# EAGLE design USBConnectors_v1 (EAGLE 9.6.2)

## Sheet 1 of 3: MAIN
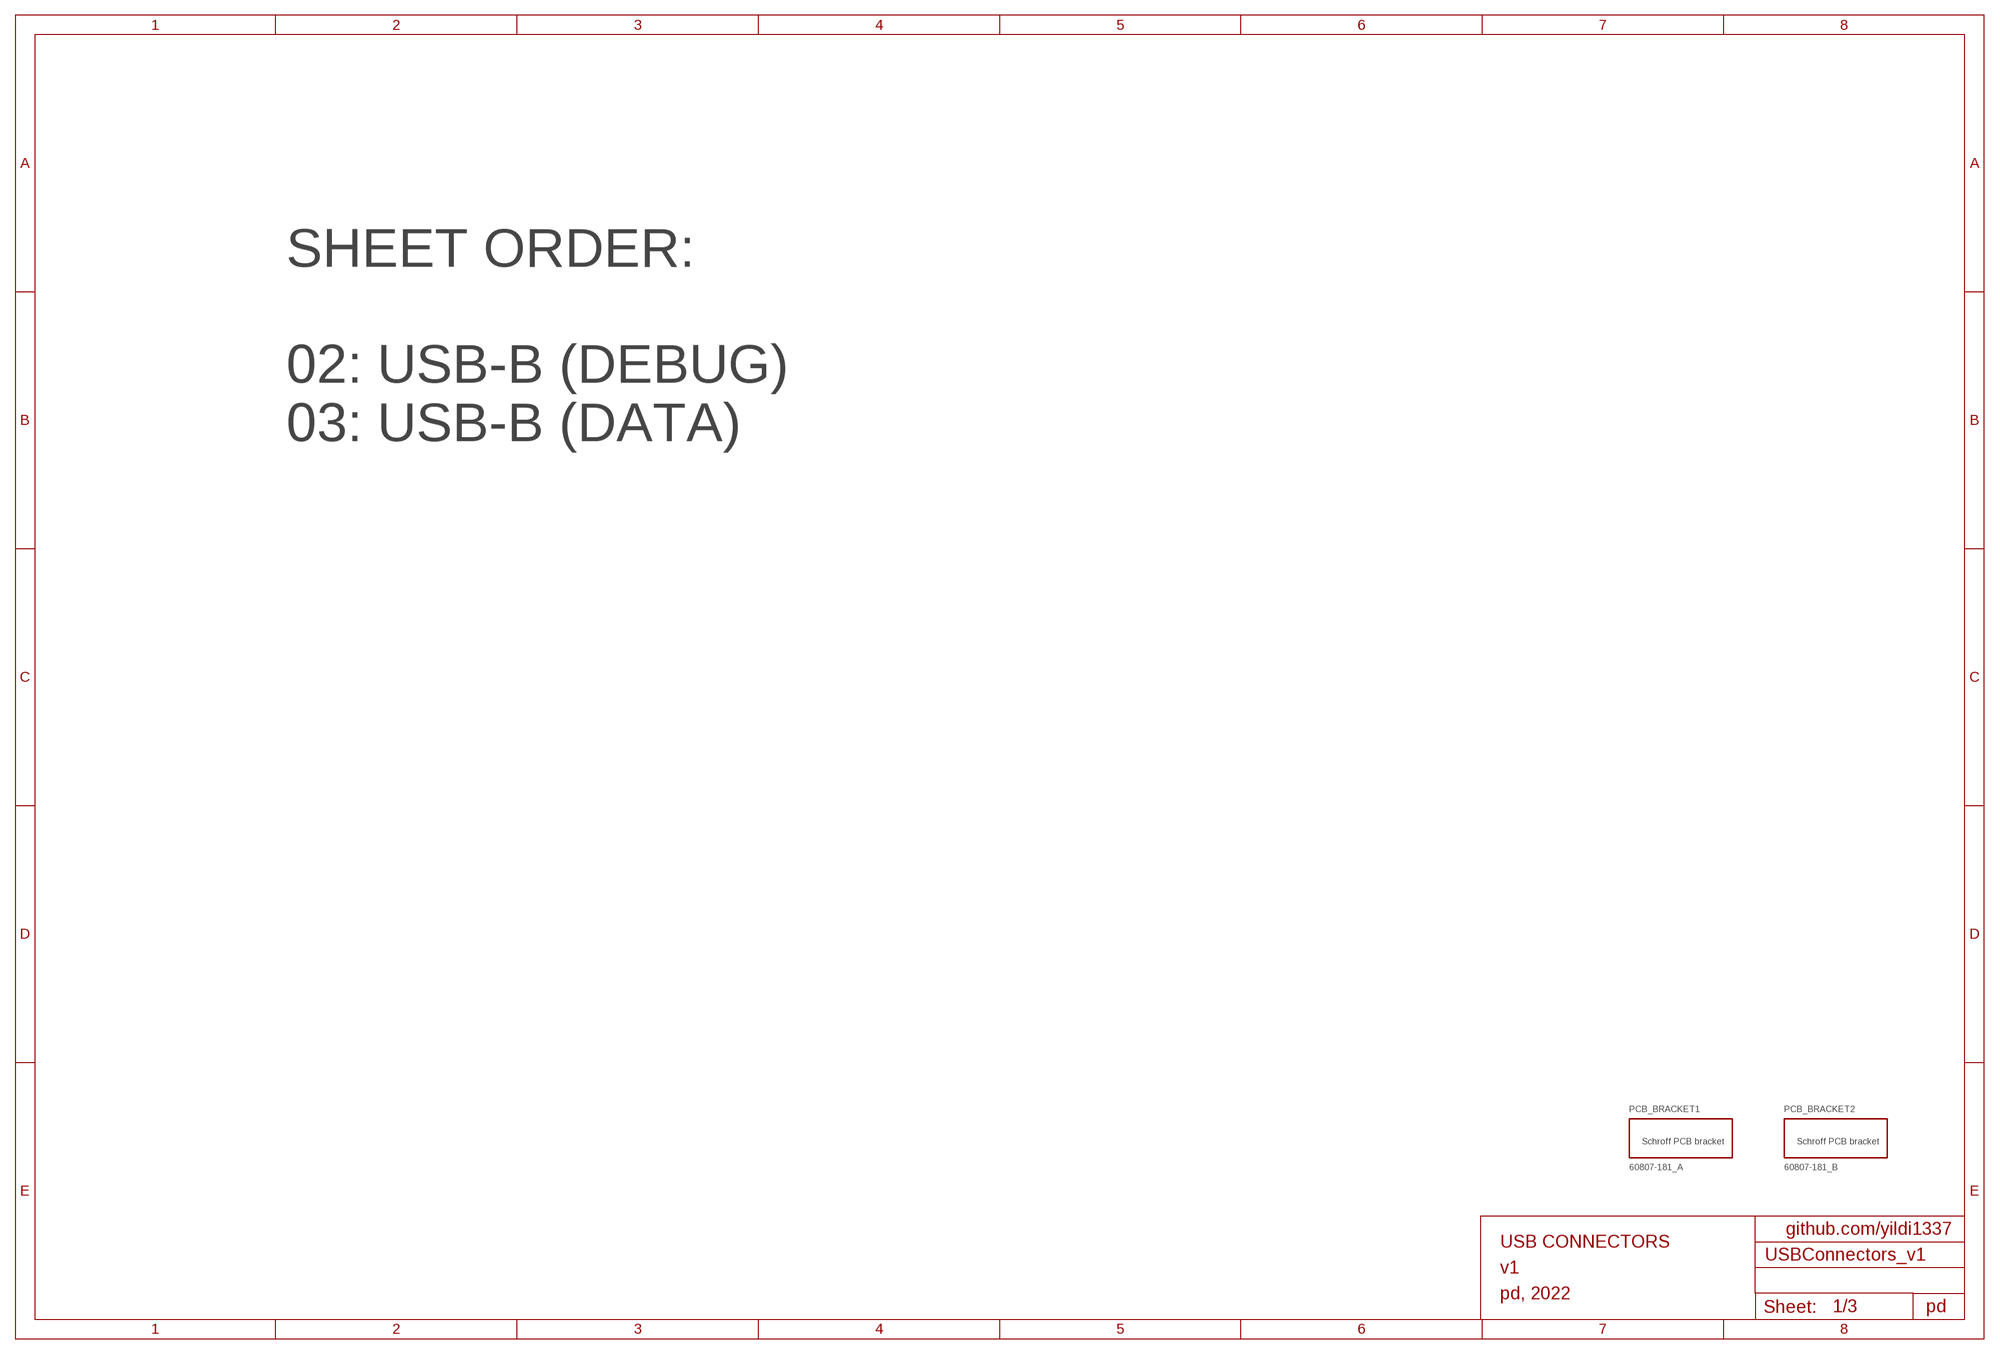
[diagram p0: schematic, sheet 1]

### Parts
PCB_BRACKET1  60807-181_A  [60807-181_A]
PCB_BRACKET2  60807-181_B  [60807-181_B]

### Notes on the sheet
- SHEET ORDER:
  
  02: USB-B (DEBUG)
  03: USB-B (DATA)
- github.com/yildi1337
- USB CONNECTORS
- v1
- pd, 2022
- pd

## Sheet 2 of 3: USB-B (DEBUG)
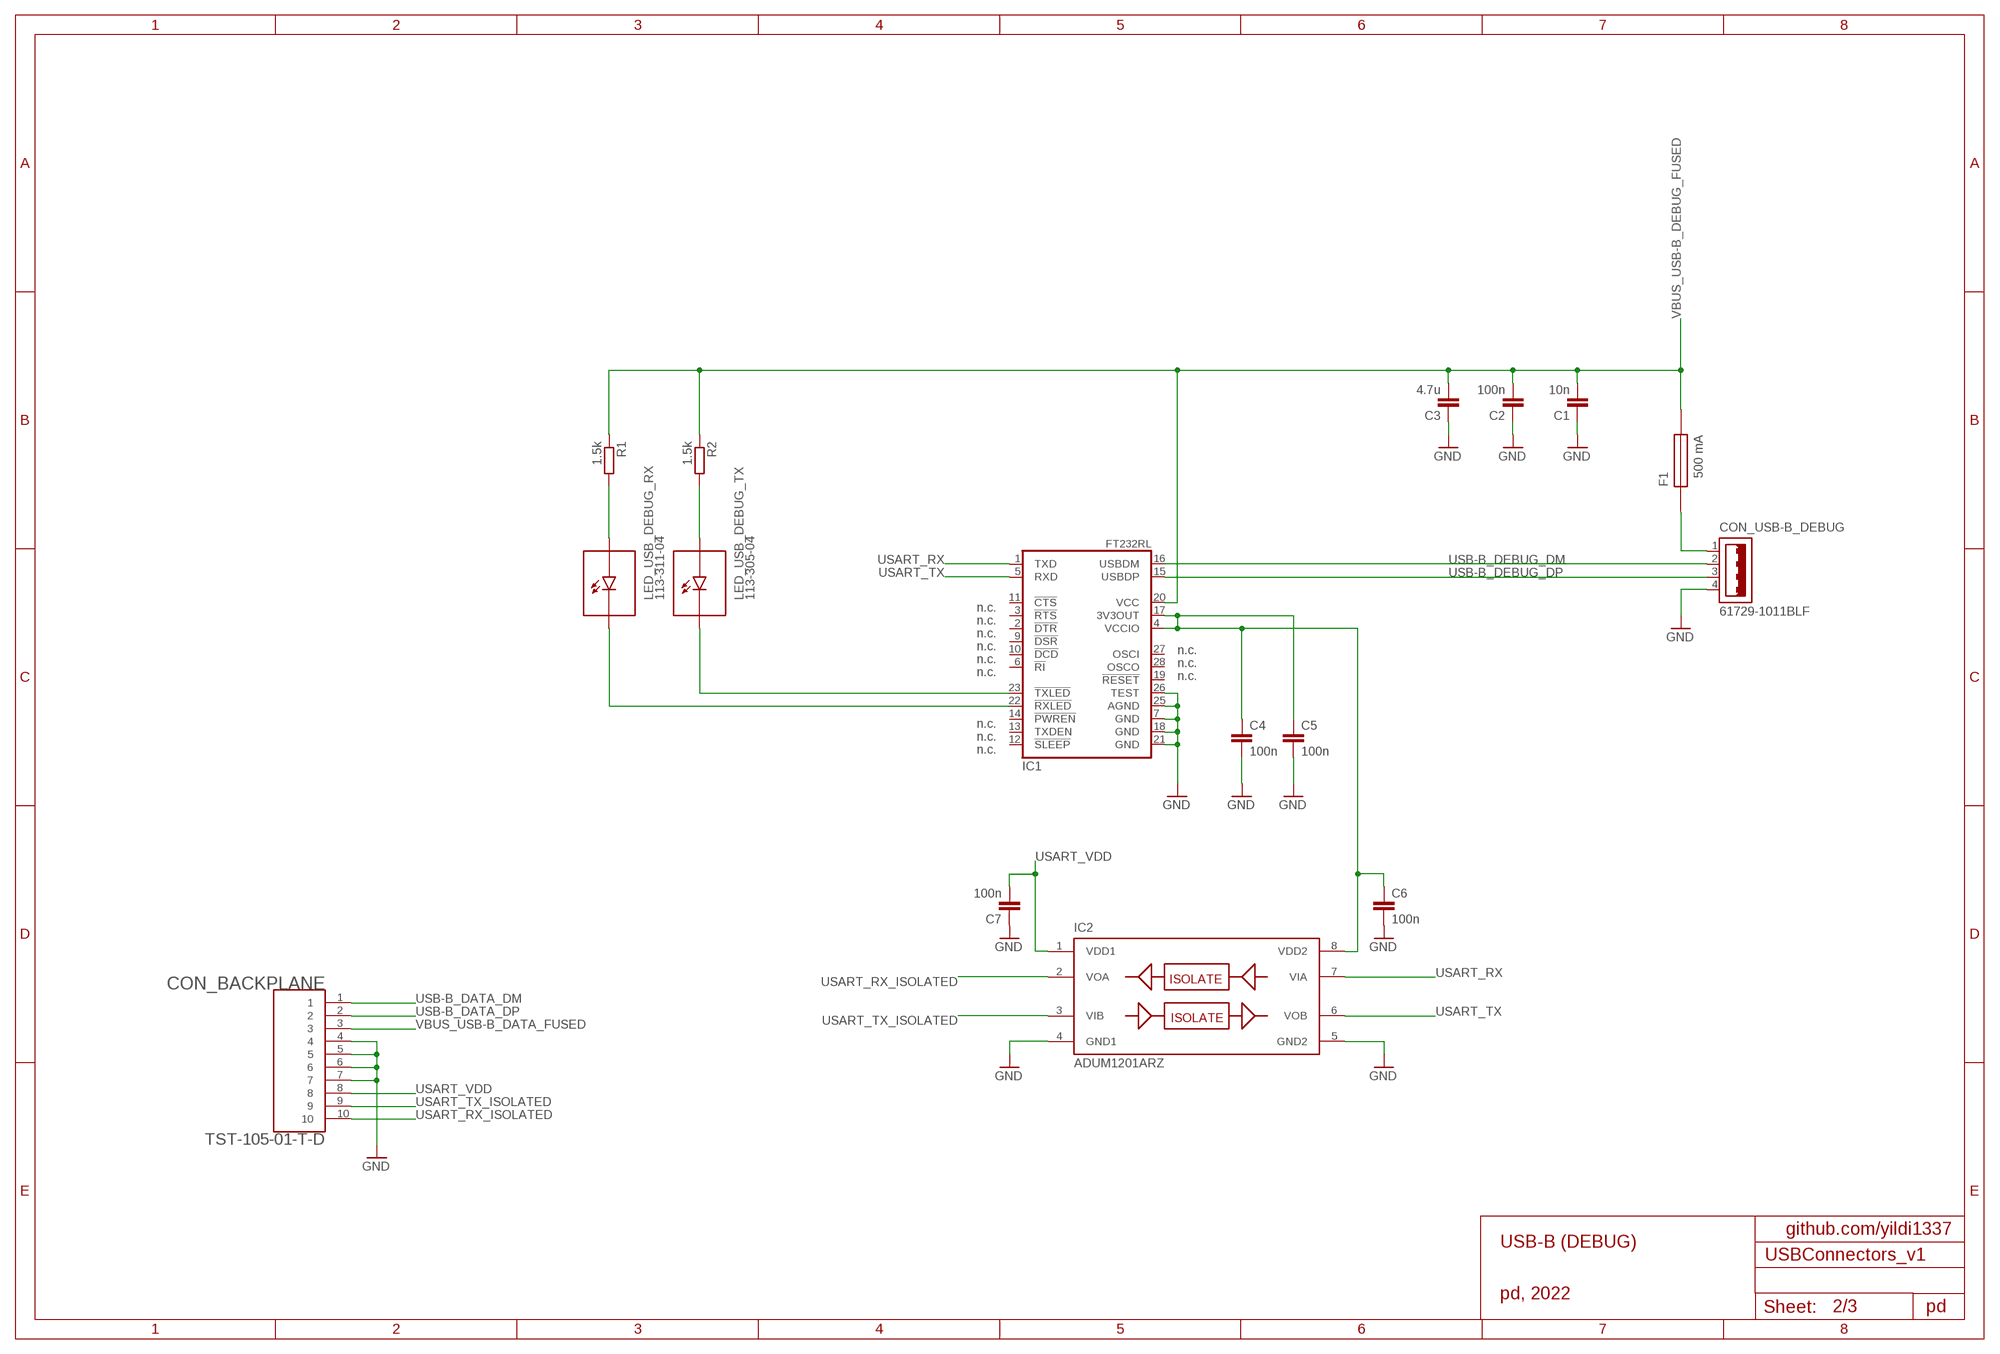
[diagram p1: schematic, sheet 2]

### Parts
C1  10n  C-EUC0603  [C0603]
C2  100n  C-EUC0603  [C0603]
C3  4.7u  C-EUC0603  [C0603]
C4  100n  C-EUC0603  [C0603]
C5  100n  C-EUC0603  [C0603]
C6  100n  C-EUC0603  [C0603]
C7  100n  C-EUC0603  [C0603]
CON_BACKPLANE  TST-105-01-T-D  [TST-105-01-T-D]
CON_USB-B_DEBUG  61729-1011BLF  [61729-1011BLF]
F1  500 mA  LITTELFUSE_466_SERIES  [LITTELFUSE_466_SERIES]
IC1  FT232RL  [FT232RL]
IC2  ADUM1201ARZ  ADUM1201  [SO8]
LED_USB_DEBUG_RX  113-311-04  [113-311-04]
LED_USB_DEBUG_TX  113-305-04  [113-305-04]
R1  1.5k  R-EU_R0603  [R0603]
R2  1.5k  R-EU_R0603  [R0603]

### Nets
GND: C1.2 C2.1 C3.1 C4.2 C5.2 C6.2 C7.1 CON_BACKPLANE.4 CON_BACKPLANE.5 CON_BACKPLANE.6 CON_BACKPLANE.7 CON_USB-B_DEBUG.4 IC1.7(GND) IC1.18(GND) IC1.21(GND) IC1.25(AGND) IC1.26(TEST) IC2.4(GND1) IC2.5(GND2) ; also sheet 3
N$1: CON_USB-B_DEBUG.1 F1.1
N$3: LED_USB_DEBUG_RX.+(A) R1.2
N$4: LED_USB_DEBUG_TX.+(A) R2.2
N$59: C4.1 C5.1 C6.1 IC1.4(VCCIO) IC1.17(3V3OUT) IC2.8(VDD2)
N$61: IC1.22(!RXLED) LED_USB_DEBUG_RX.-(C)
N$63: IC1.23(!TXLED) LED_USB_DEBUG_TX.-(C)
USART_RX: IC1.1(TXD) IC2.7(VIA)
USART_RX_ISOLATED: CON_BACKPLANE.10 IC2.2(VOA)
USART_TX: IC1.5(RXD) IC2.6(VOB)
USART_TX_ISOLATED: CON_BACKPLANE.9 IC2.3(VIB)
USART_VDD: C7.2 CON_BACKPLANE.8 IC2.1(VDD1)
USB-B_DATA_DM: CON_BACKPLANE.1 ; also sheet 3
USB-B_DATA_DP: CON_BACKPLANE.2 ; also sheet 3
USB-B_DEBUG_DM: CON_USB-B_DEBUG.2 IC1.16(USBDM)
USB-B_DEBUG_DP: CON_USB-B_DEBUG.3 IC1.15(USBDP)
VBUS_USB-B_DATA_FUSED: CON_BACKPLANE.3 ; also sheet 3
VBUS_USB-B_DEBUG_FUSED: C1.1 C2.2 C3.2 F1.2 IC1.20(VCC) R1.1 R2.1
Unconnected: IC1.2(!DTR) IC1.3(!RTS) IC1.6(!RI) IC1.9(!DSR) IC1.10(!DCD) IC1.11(!CTS) IC1.12(!SLEEP) IC1.13(TXDEN) IC1.14(!PWREN) IC1.19(!RESET) IC1.27(OSCI) IC1.28(OSCO)

### Notes on the sheet
- n.c.
- n.c.
- n.c.
- n.c.
- n.c. | n.c.
- n.c. | n.c.
- n.c.
- n.c.
- n.c.
- n.c.
- github.com/yildi1337
- USB-B (DEBUG)
- pd, 2022
- pd

## Sheet 3 of 3: USB-B (DATA)
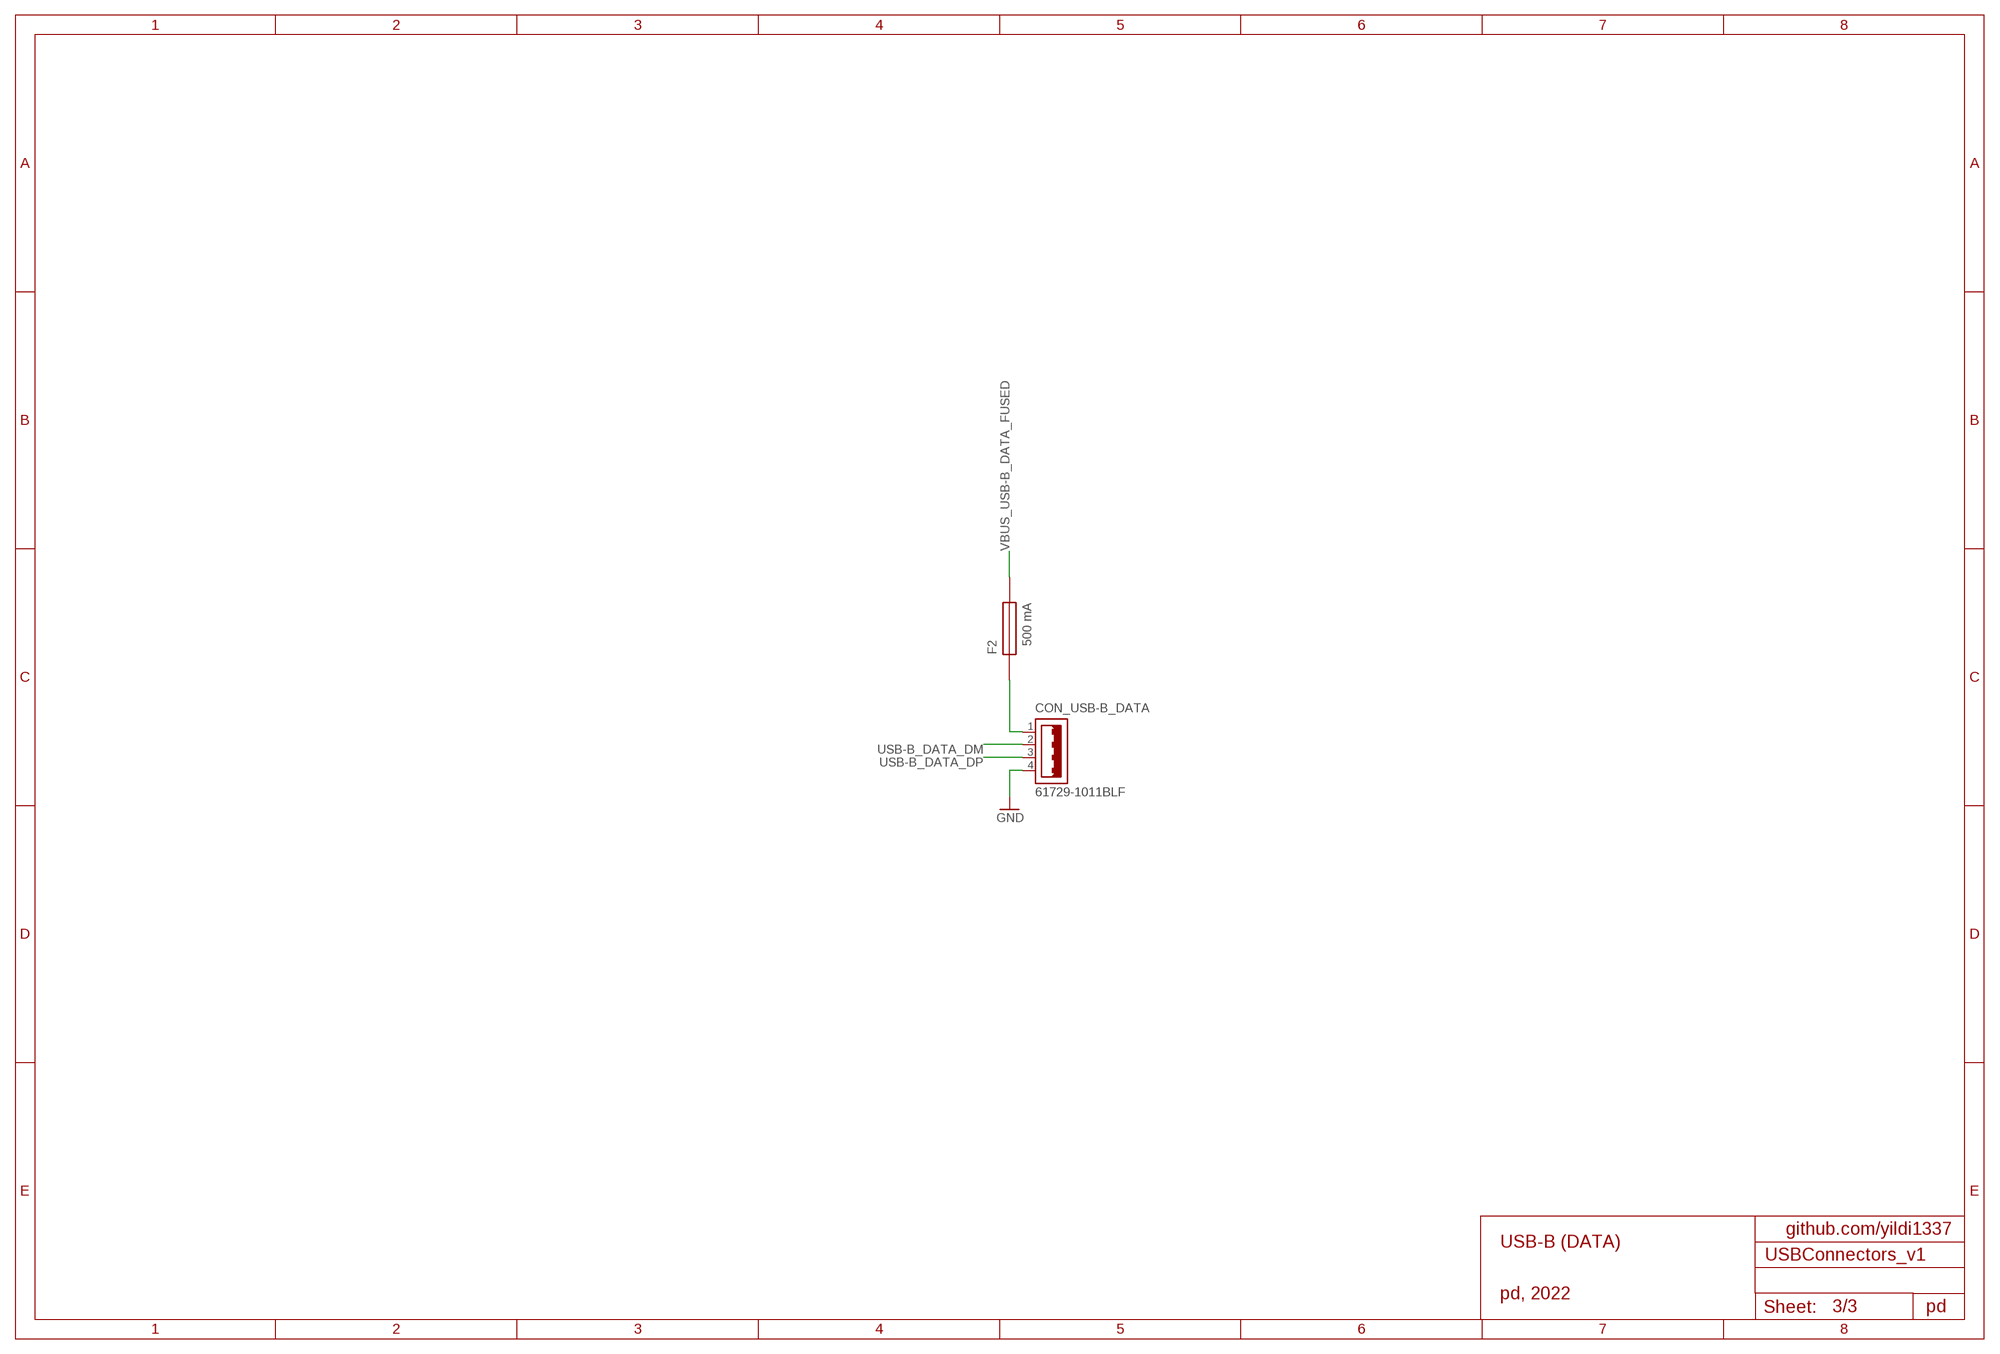
[diagram p2: schematic, sheet 3]

### Parts
CON_USB-B_DATA  61729-1011BLF  [61729-1011BLF]
F2  500 mA  LITTELFUSE_466_SERIES  [LITTELFUSE_466_SERIES]

### Nets
GND: CON_USB-B_DATA.4 ; also sheet 2
USB-B_DATA_DM: CON_USB-B_DATA.2 ; also sheet 2
USB-B_DATA_DP: CON_USB-B_DATA.3 ; also sheet 2
VBUS_USB-B_DATA_FUSED: F2.2 ; also sheet 2
VBUS_USB-B_NF: CON_USB-B_DATA.1 F2.1

### Notes on the sheet
- github.com/yildi1337
- USB-B (DATA)
- pd, 2022
- pd

## Library data of the parts
C1-C7 = RCL:C-EU: CAPACITOR, European symbol; SPICEPREFIX: C
CON_BACKPLANE = TST-105-01-T-D:TST-105-01-T-D
CON_USB-B_DATA CON_USB-B_DEBUG = 61729-1011BLF:61729-1011BLF
F1 F2 = LITTELFUSE_466_SERIES:LITTELFUSE_466_SERIES
IC1 = FT232RL:FT232RL
IC2 = ADUM120X:ADUM1201
LED_USB_DEBUG_RX = 113-311-04:113-311-04
LED_USB_DEBUG_TX = 113-305-04:113-305-04
PCB_BRACKET1 = 60807-181:60807-181_A
PCB_BRACKET2 = 60807-181:60807-181_B
R1 R2 = RCL:R-EU_: RESISTOR, European symbol; SPICEPREFIX: R

## Board
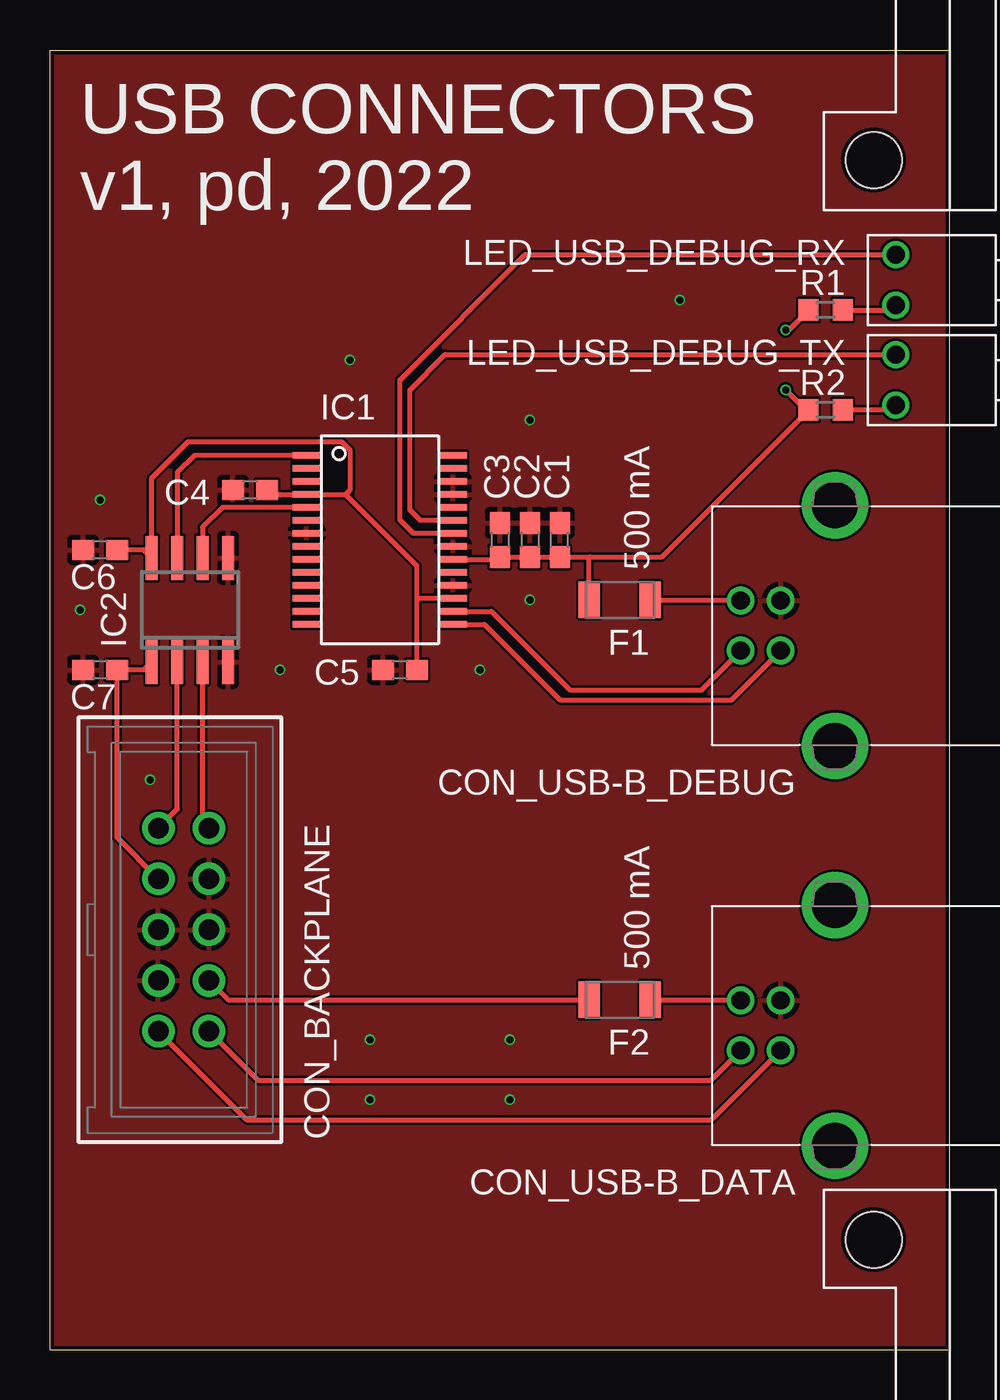
[diagram p3: board, top side]
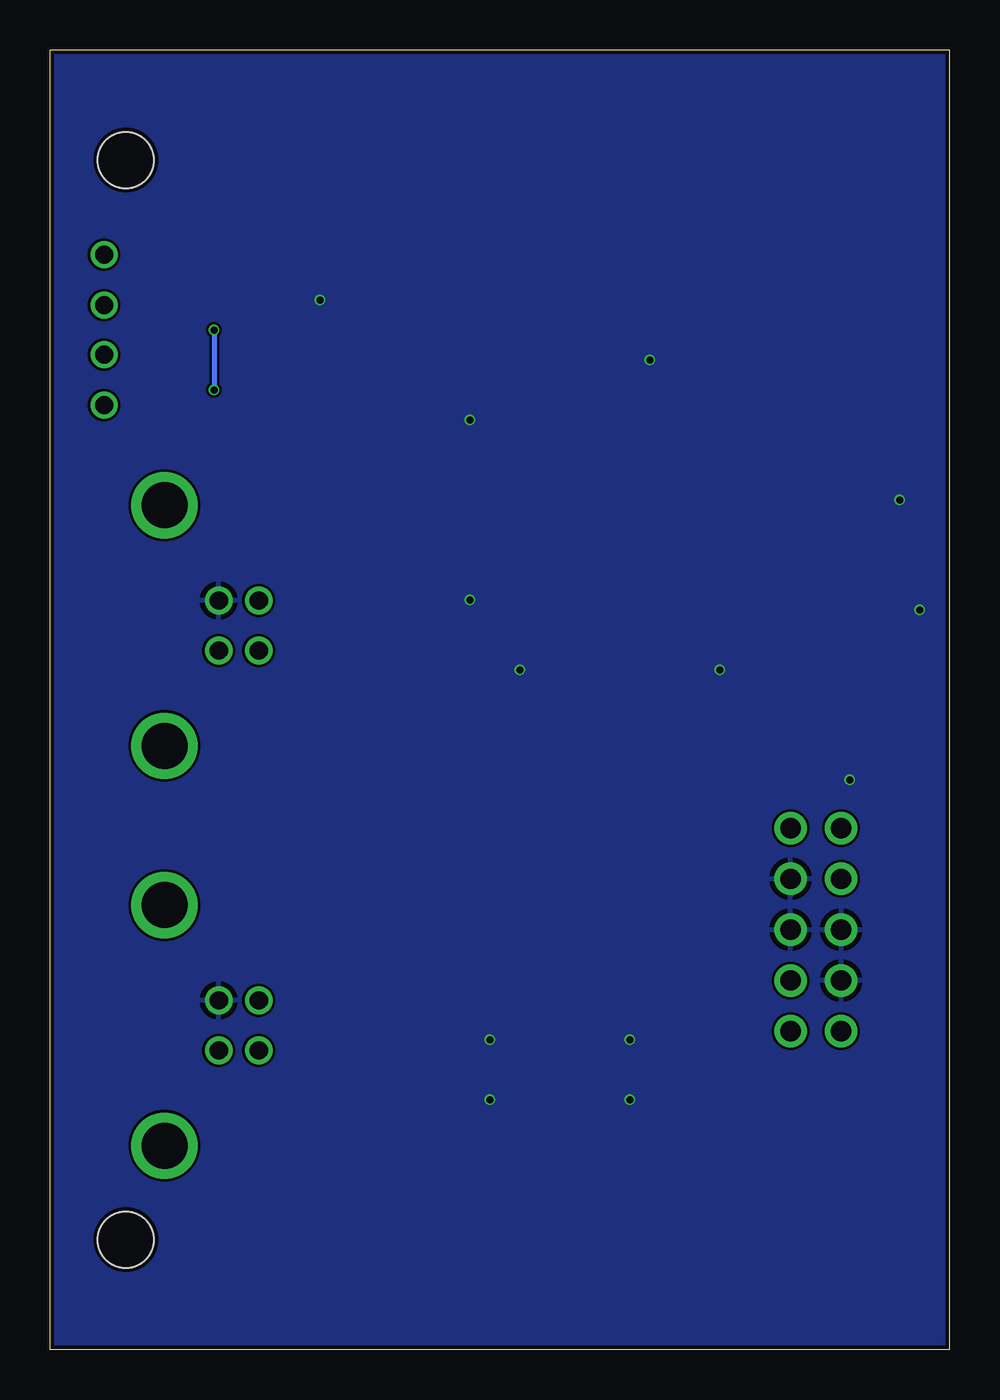
[diagram p4: board, bottom side, seen from below]

Size 45 x 65 mm. Coordinates in mm from the lower left corner, seen from the top.
Outline: 0,0 45,0 45,65 0,65 0,0
Copper layers (1*16): Top 0.035559375mm / dielectric 1.6mm / Bottom 0.035559375mm
Design rules "jlcpcb2layer": minimum track width 5mil, minimum drill 12mil, track to track 5mil, track to pad 5mil, pad to pad 5mil, via to via 5mil, smd to smd 5mil, copper to edge 8mil, drill to drill 6mil, minimum pad ring 5mil, minimum via ring 3mil, stop-mask expansion 2.5mil, vias tented up to drill 0mil, thermal gap 10mil

### Footprints (pad centres in the part's own frame; a part is rotated, then mirrored left to right if it is on the bottom)
C0603 = smd 1.1 x 1: 1 -0.85,0; 2 0.85,0
TST-105-01-T-D = drill 1.02 pad 1.62: 1 -5.08,-1.46; 2 -5.08,1.08; 3 -2.54,-1.46; 4 -2.54,1.08; 5 0,-1.46; 6 0,1.08; 7 2.54,-1.46; 8 2.54,1.08; 9 5.08,-1.46; 10 5.08,1.08
61729-1011BLF = drill 0.92 pad 1.27: 1 1.461,6.741; 2 -1.039,6.741; 3 -1.039,4.741; 4 1.461,4.741 | drill 2.3 pad 3: M1 -5.809,2.031; M2 6.231,2.031
LITTELFUSE_466_SERIES = smd 1.06 x 1.82: 1 -1.528,0; 2 1.528,0
FT232RL = smd 0.348 x 1.397: 1 -4.225,-3.656; 2 -3.575,-3.656; 3 -2.925,-3.656; 4 -2.275,-3.656; 5 -1.625,-3.656; 6 -0.975,-3.656; 7 -0.325,-3.656; 8 0.325,-3.656; 9 0.975,-3.656; 10 1.625,-3.656; 11 2.275,-3.656; 12 2.925,-3.656; 13 3.575,-3.656; 14 4.225,-3.656; 15 4.225,3.656; 16 3.575,3.656; 17 2.925,3.656; 18 2.275,3.656; 19 1.625,3.656; 20 0.975,3.656; 21 0.325,3.656; 22 -0.325,3.656; 23 -0.975,3.656; 24 -1.625,3.656; 25 -2.275,3.656; 26 -2.925,3.656; 27 -3.575,3.656; 28 -4.225,3.656
SO8 = smd 2.2 x 0.6: 1 -2.6,1.905; 2 -2.6,0.635; 3 -2.6,-0.635; 4 -2.6,-1.905; 5 2.6,-1.905; 6 2.6,-0.635; 7 2.6,0.635; 8 2.6,1.905
113-311-04 = drill 0.9: + -1.27,0; - 1.27,0
113-305-04 = drill 0.9: + -1.27,0; - 1.27,0
60807-181_A = hole 2.8: 3,-3.8
60807-181_B = hole 2.8: -3,-3.8
R0603 = smd 1 x 1.1: 1 -0.85,0; 2 0.85,0

### Placement (x,y rotation side)
C1  25.5,40.5 90 top
C2  24,40.5 270 top
C3  22.5,40.5 270 top
C4  10,43 180 top
C5  17.5,34 180 top
C6  2.5,40 180 top
C7  2.5,34 0 top
CON_BACKPLANE  6.5,21 90 top
CON_USB-B_DATA  41.3,16 90 top
CON_USB-B_DEBUG  41.3,36 90 top
F1  28.5,37.5 180 top
F2  28.5,17.5 180 top
IC1  16.5,40.5 270 top
IC2  7,37 90 top
LED_USB_DEBUG_RX  42.3,53.5 90 top
LED_USB_DEBUG_TX  42.3,48.5 90 top
PCB_BRACKET1  45,62.5 270 top
PCB_BRACKET2  45,2.5 270 top
R1  38.8,52 0 top
R2  38.8,47 0 top

### Tracks (layer width: path | path; a pad name or v marks a point on that pad's centre or on a via)
GND  (via drill 0.35)
  other vias: 31.5,52.5 2.5,42.5 23,15.5 16,15.5 21.5,34 11.5,34 15,49.5 24,46.5 5,28.5 16,12.5 23,12.5 24,37.5 1.5,37
  pour Top: 0,0 45,0 45,65 0,65
  pour Bottom: 0,0 45,0 45,65 0,65
N$1
  Top 0.254: CON_USB-B_DEBUG.1 30.07,37.46 F1.1
N$3
  Top 0.254: R1.2 42.07,52 LED_USB_DEBUG_RX.+
N$4
  Top 0.254: LED_USB_DEBUG_TX.+ 42.07,47 R2.2
N$59
  Top 0.254: C6.1 4.7,40 IC2.8 5.09,43.59 6.91,45.41 14.6,45.41 15,45 15,43 14.78,42.77 | C4.1 11.07,42.77 IC1.4 14.78,42.77 | 18.35,37.5 18.35,39.2 14.78,42.77 | IC1.17 18.43,37.58 18.35,37.5 | C5.1 18.35,37.5
N$61
  Top 0.254: IC1.22 18.18,40.83 17.5,41.5 17.5,48.5 23.77,54.77 LED_USB_DEBUG_RX.-
N$63
  Top 0.254: IC1.23 18.52,41.48 18,42 18,48 19.77,49.77 LED_USB_DEBUG_TX.-
USART_RX
  Top 0.254: IC1.1 7.22,44.73 6.37,43.87 IC2.7
USART_RX_ISOLATED
  Top 0.254: CON_BACKPLANE.10 6.37,27.02 IC2.2
USART_TX
  Top 0.254: IC1.5 8.62,42.12 7.63,41.13 IC2.6
USART_TX_ISOLATED
  Top 0.254: CON_BACKPLANE.9 7.63,26.41 IC2.3
USART_VDD
  Top 0.254: IC2.1 4.7,34 C7.2 3.35,25.61 CON_BACKPLANE.8
USB-B_DATA_DM
  Top 0.254: CON_BACKPLANE.1 10.42,13.46 33.06,13.46 CON_USB-B_DATA.2
USB-B_DATA_DP
  Top 0.254: CON_BACKPLANE.2 9.84,11.5 33.1,11.5 CON_USB-B_DATA.3
USB-B_DEBUG_DM
  Top 0.254: IC1.16 22.07,36.92 26,33 32.6,33 CON_USB-B_DEBUG.2
USB-B_DEBUG_DP
  Top 0.254: IC1.15 21.73,36.27 25.5,32.5 34.1,32.5 CON_USB-B_DEBUG.3
VBUS_USB-B_DATA_FUSED
  Top 0.254: CON_BACKPLANE.3 8.92,17.5 F2.2
VBUS_USB-B_DEBUG_FUSED  (via drill 0.35)
  Top 0.254: IC1.20 22.38,39.52 C3.2 C2.2 C1.1 27,39.65 | 27,39.65 30.6,39.65 R2.1 37.8,47 v36.8,48 | R1.1 36.95,51 v36.8,51 | F1.2 26.97,39.62 27,39.65
  Bottom 0.254: v36.8,51 v36.8,48
VBUS_USB-B_NF
  Top 0.254: CON_USB-B_DATA.1 30.07,17.46 F2.1

### Text on the board
tPlace: USB CONNECTORS / v1, pd, 2022 | 500 mA | 500 mA